# Altium schematic sheet STM32F405RGT6TR.SchDoc
size 431 x 279 mm; SheetNumber: 1; SheetTotal: 1
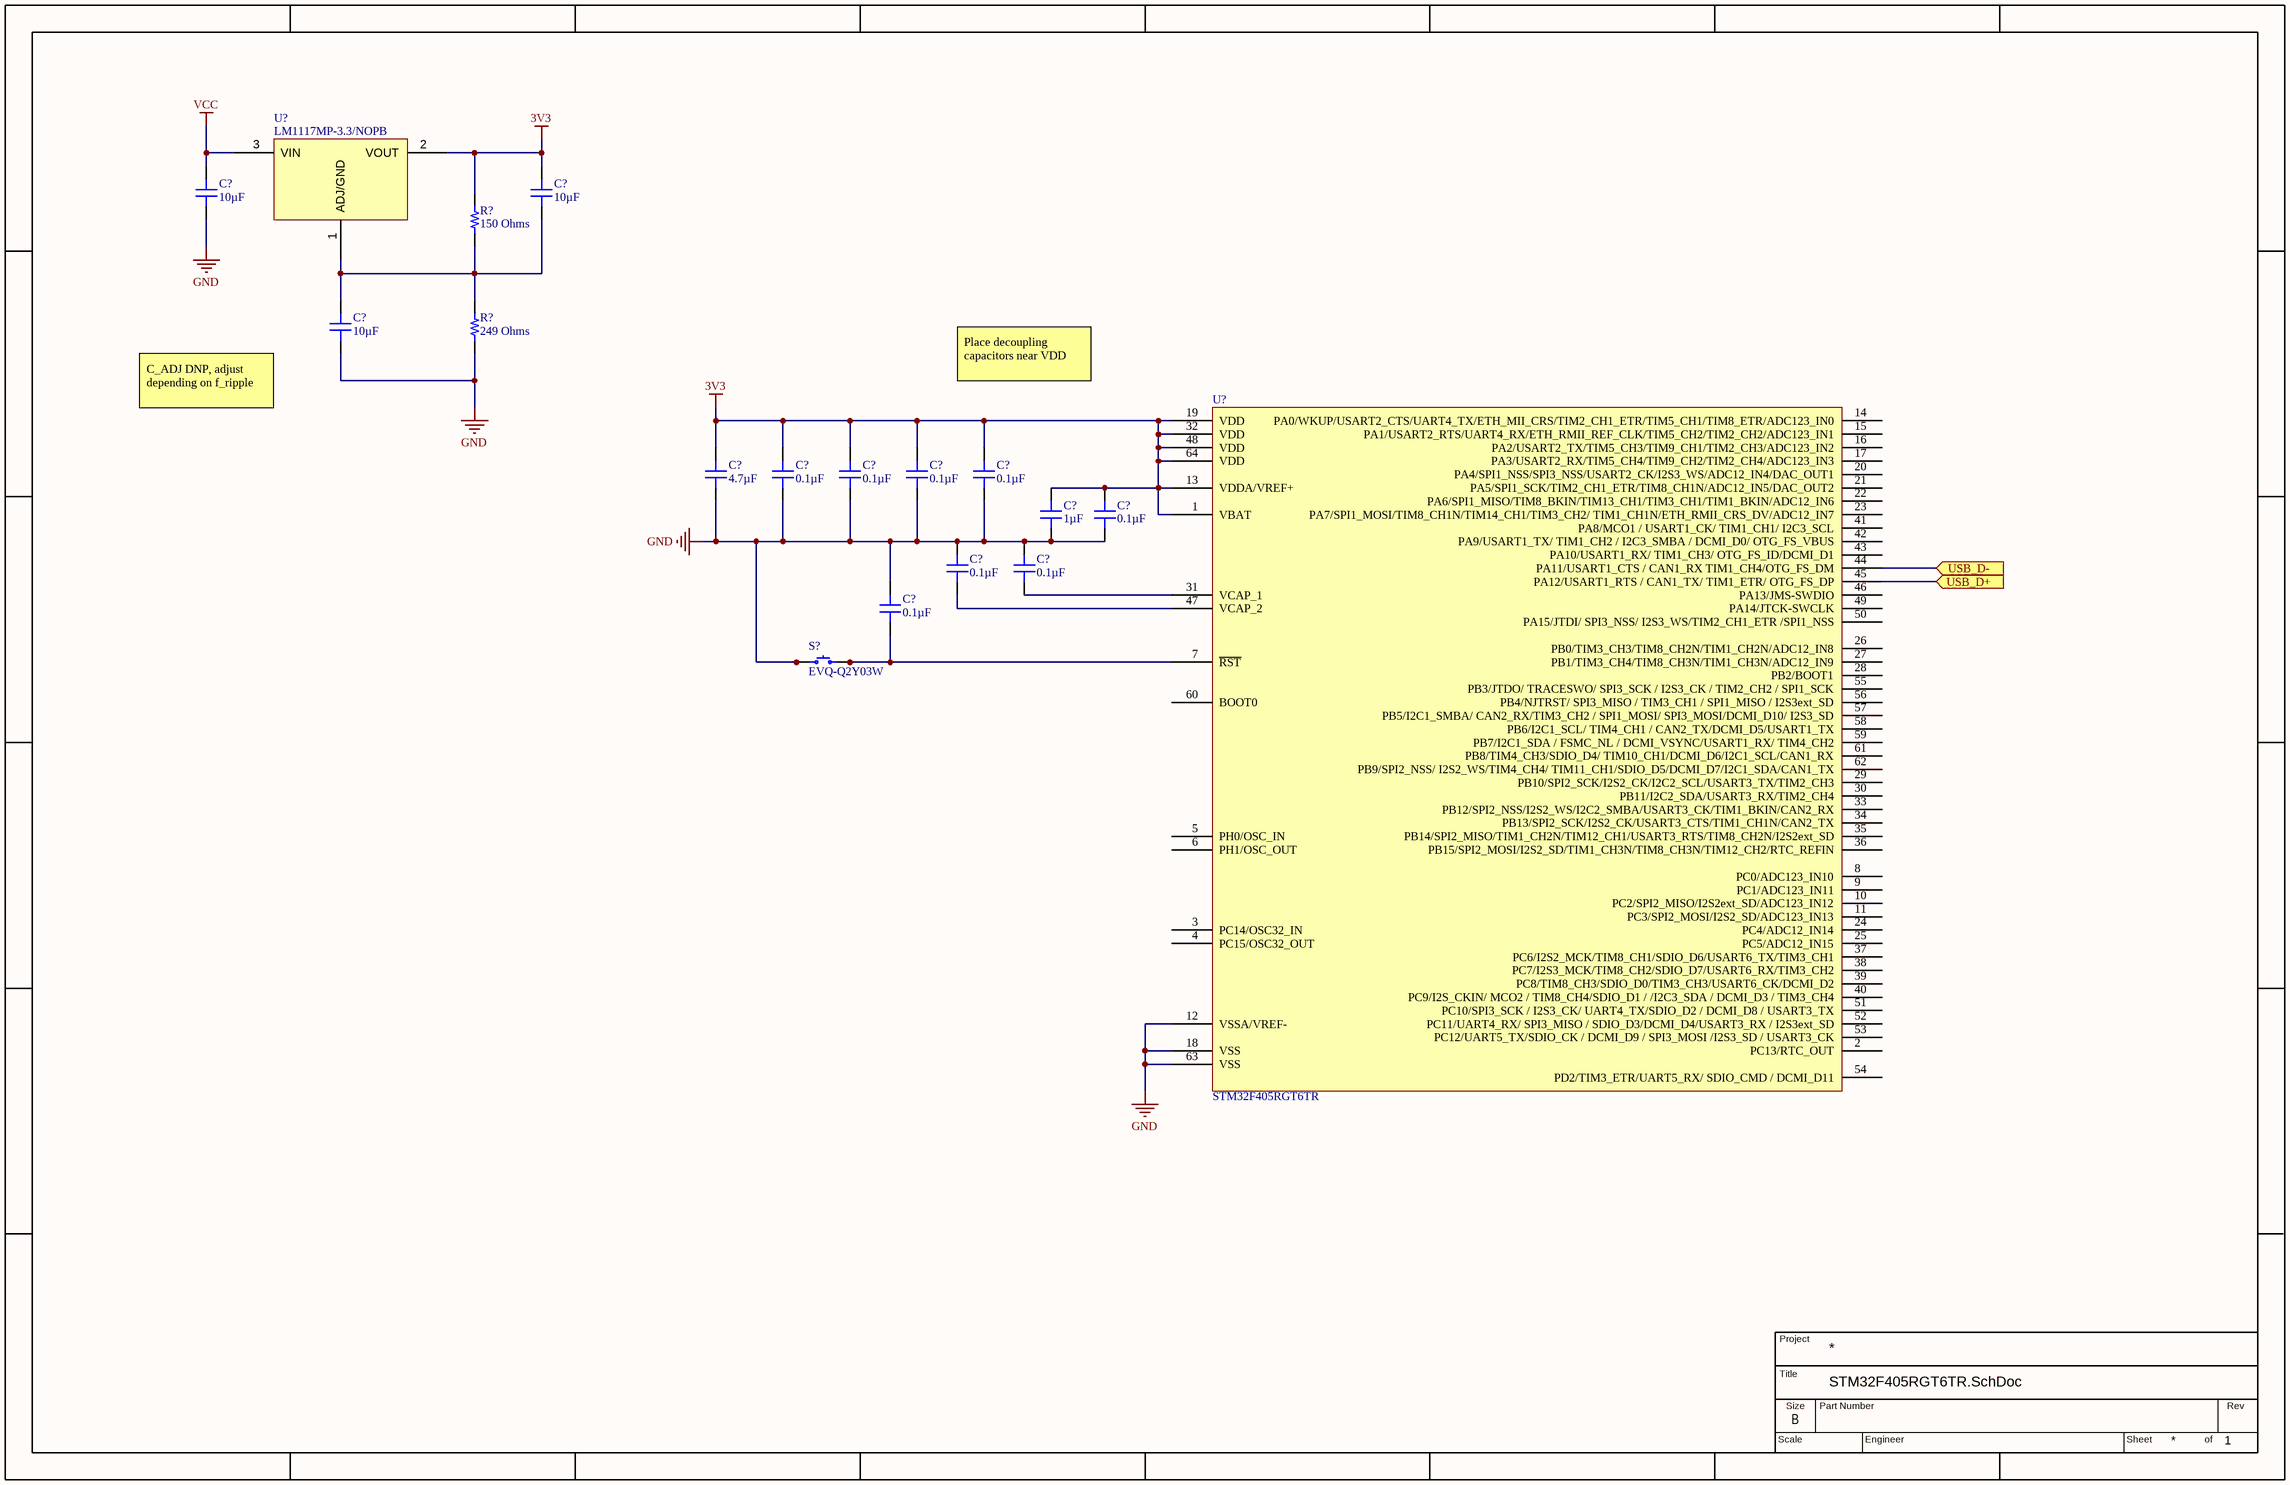
[diagram p0: STM32F405RGT6TR.SchDoc]

## Parts
(Parts that share a designator on the sheet are numbered #1, #2 ... from top to bottom, then left to right.)
C?#1  10µF  [CAP 1210_3225 - 2.8MM]
C?#2  10µF  [CAP 1210_3225 - 2.8MM]
C?#3  10µF  [CAP 1210_3225 - 2.8MM]
C?#4  4.7µF  [CAP 0805_2012]
C?#5  0.1µF  [CAP 0603_1608]
C?#6  0.1µF  [CAP 0603_1608]
C?#7  0.1µF  [CAP 0603_1608]
C?#8  0.1µF  [CAP 0603_1608]
C?#9  1µF  [CAP 0805_2012]
C?#10  0.1µF  [CAP 0603_1608]
C?#11  0.1µF  [CAP 0603_1608]
C?#12  0.1µF  [CAP 0603_1608]
C?#13  0.1µF  [CAP 0603_1608]
R?#1  150 Ohms  [RES 0402_1005]
R?#2  249 Ohms  [RES 0402_1005]
S?  EVQ-Q2Y03W  [PANASONIC EVQQ2]
U?#1  LM1117MP-3.3/NOPB
U?#2  STM32F405RGT6TR  [ST LQFP-64 10X10MM]

## Ports
USB_D+ (in), USB_D- (in)

## Nets
3V3: C?#2.2 C?#4.2 C?#5.2 C?#6.2 C?#7.2 C?#8.2 C?#9.2 C?#10.2 R?#1.2 U?#1.2(VOUT) U?#2.1(VBAT) U?#2.13(VDDA/VREF+) U?#2.19(VDD) U?#2.32(VDD) U?#2.48(VDD) U?#2.64(VDD)
GND: C?#1.1 C?#3.1 C?#4.1 C?#5.1 C?#6.1 C?#7.1 C?#8.1 C?#9.1 C?#10.1 C?#11.1 C?#12.1 C?#13.1 R?#2.1 S?.1 S?.2 U?#2.12(VSSA/VREF-) U?#2.18(VSS) U?#2.63(VSS)
VCC: C?#1.2 U?#1.3(VIN)
USB_D+: U?#2.45(PA12/USART1_RTS_/_CAN1_TX/_TIM1_ETR/_OTG_FS_DP) ; port USB_D+
USB_D-: U?#2.44(PA11/USART1_CTS_/_CAN1_RX_TIM1_CH4/OTG_FS_DM) ; port USB_D-
NetC?#2_1: C?#2.1 C?#3.2 R?#1.1 R?#2.2 U?#1.1(ADJ/GND)
NetC?#11_2: C?#11.2 U?#2.47(VCAP_2)
NetC?#12_2: C?#12.2 U?#2.31(VCAP_1)
NetC?#13_2: C?#13.2 S?.3 S?.4 U?#2.7(~{RST})

Not connected (* = marked no-connect by the designer): U?#2 2(PC13/RTC_OUT) 3(PC14/OSC32_IN) 4(PC15/OSC32_OUT) 5(PH0/OSC_IN) 6(PH1/OSC_OUT) 8(PC0/ADC123_IN10) 9(PC1/ADC123_IN11) 10(PC2/SPI2_MISO/I2S2ext_SD/ADC123_IN12) 11(PC3/SPI2_MOSI/I2S2_SD/ADC123_IN13) 14(PA0/WKUP/USART2_CTS/UART4_TX/ETH_MII_CRS/TIM2_CH1_ETR/TIM5_CH1/TIM8_ETR/ADC123_IN0) 15(PA1/USART2_RTS/UART4_RX/ETH_RMII_REF_CLK/TIM5_CH2/TIM2_CH2/ADC123_IN1) 16(PA2/USART2_TX/TIM5_CH3/TIM9_CH1/TIM2_CH3/ADC123_IN2) 17(PA3/USART2_RX/TIM5_CH4/TIM9_CH2/TIM2_CH4/ADC123_IN3) 20(PA4/SPI1_NSS/SPI3_NSS/USART2_CK/I2S3_WS/ADC12_IN4/DAC_OUT1) 21(PA5/SPI1_SCK/TIM2_CH1_ETR/TIM8_CH1N/ADC12_IN5/DAC_OUT2) 22(PA6/SPI1_MISO/TIM8_BKIN/TIM13_CH1/TIM3_CH1/TIM1_BKIN/ADC12_IN6) 23(PA7/SPI1_MOSI/TIM8_CH1N/TIM14_CH1/TIM3_CH2/_TIM1_CH1N/ETH_RMII_CRS_DV/ADC12_IN7) 24(PC4/ADC12_IN14) 25(PC5/ADC12_IN15) 26(PB0/TIM3_CH3/TIM8_CH2N/TIM1_CH2N/ADC12_IN8) 27(PB1/TIM3_CH4/TIM8_CH3N/TIM1_CH3N/ADC12_IN9) 28(PB2/BOOT1) 29(PB10/SPI2_SCK/I2S2_CK/I2C2_SCL/USART3_TX/TIM2_CH3) 30(PB11/I2C2_SDA/USART3_RX/TIM2_CH4) 33(PB12/SPI2_NSS/I2S2_WS/I2C2_SMBA/USART3_CK/TIM1_BKIN/CAN2_RX) 34(PB13/SPI2_SCK/I2S2_CK/USART3_CTS/TIM1_CH1N/CAN2_TX) 35(PB14/SPI2_MISO/TIM1_CH2N/TIM12_CH1/USART3_RTS/TIM8_CH2N/I2S2ext_SD) 36(PB15/SPI2_MOSI/I2S2_SD/TIM1_CH3N/TIM8_CH3N/TIM12_CH2/RTC_REFIN) 37(PC6/I2S2_MCK/TIM8_CH1/SDIO_D6/USART6_TX/TIM3_CH1) 38(PC7/I2S3_MCK/TIM8_CH2/SDIO_D7/USART6_RX/TIM3_CH2) 39(PC8/TIM8_CH3/SDIO_D0/TIM3_CH3/USART6_CK/DCMI_D2) 40(PC9/I2S_CKIN/_MCO2_/_TIM8_CH4/SDIO_D1_/_/I2C3_SDA_/_DCMI_D3_/_TIM3_CH4) 41(PA8/MCO1_/_USART1_CK/_TIM1_CH1/_I2C3_SCL) 42(PA9/USART1_TX/_TIM1_CH2_/_I2C3_SMBA_/_DCMI_D0/_OTG_FS_VBUS) 43(PA10/USART1_RX/_TIM1_CH3/_OTG_FS_ID/DCMI_D1) 46(PA13/JMS-SWDIO) 49(PA14/JTCK-SWCLK) 50(PA15/JTDI/_SPI3_NSS/_I2S3_WS/TIM2_CH1_ETR_/SPI1_NSS) 51(PC10/SPI3_SCK_/_I2S3_CK/_UART4_TX/SDIO_D2_/_DCMI_D8_/_USART3_TX) 52(PC11/UART4_RX/_SPI3_MISO_/_SDIO_D3/DCMI_D4/USART3_RX_/_I2S3ext_SD) 53(PC12/UART5_TX/SDIO_CK_/_DCMI_D9_/_SPI3_MOSI_/I2S3_SD_/_USART3_CK) 54(PD2/TIM3_ETR/UART5_RX/_SDIO_CMD_/_DCMI_D11) 55(PB3/JTDO/_TRACESWO/_SPI3_SCK_/_I2S3_CK_/_TIM2_CH2_/_SPI1_SCK) 56(PB4/NJTRST/_SPI3_MISO_/_TIM3_CH1_/_SPI1_MISO_/_I2S3ext_SD) 57(PB5/I2C1_SMBA/_CAN2_RX/TIM3_CH2_/_SPI1_MOSI/_SPI3_MOSI/DCMI_D10/_I2S3_SD) 58(PB6/I2C1_SCL/_TIM4_CH1_/_CAN2_TX/DCMI_D5/USART1_TX) 59(PB7/I2C1_SDA_/_FSMC_NL_/_DCMI_VSYNC/USART1_RX/_TIM4_CH2) 60(BOOT0) 61(PB8/TIM4_CH3/SDIO_D4/_TIM10_CH1/DCMI_D6/I2C1_SCL/CAN1_RX) 62(PB9/SPI2_NSS/_I2S2_WS/TIM4_CH4/_TIM11_CH1/SDIO_D5/DCMI_D7/I2C1_SDA/CAN1_TX)

## Notes on the sheet
- C_ADJ DNP, adjust depending on f_ripple
- Place decoupling capacitors near VDD
- Title
- Project
- Scale
- Size
- B
- Part Number
- Engineer
- Sheet
- of
- Rev

## Library data of the parts
C?#1-C?#3 = C1210C106M3RACTU: CAP CER 10UF 25V X7R 1210; Manufacturer: KEMET; Tolerance: ±20%; Part Number: C1210C106M3RACTU; Value: 10µF; Applications: Bypass, Decoupling; Capacitance: 10µF; ComponentLink1Description: Datasheet; ComponentLink1URL: https://api.kemet.com/component-edge/download/datasheet/C1210C106M3RACTU.pdf; ComponentLink2Description: DigiKey Link; ComponentLink2URL: http://digikey.com/product-detail/en/kemet/C1210C106M3RACTU/399-8228-1-ND/3471951; Device Package: 1210 (3225 Metric); LastUpdated: 9/2/2020 1:10:52 AM; Lifecycle Status: Active; Minimum Order: 1; Mounting Type: Surface Mount, MLCC; Operating Temperature: -55°C ~ 125°C; Package / Case: 1210 (3225 Metric); Packaging: TapeAndReel; PartId: 23712; Part Status: Active; Price: 0.14; Series: SMD Comm X7R; Size / Dimension: 0.126" L x 0.098" W (3.20mm x 2.50mm); Supplier 1: DigiKey; Supplier Part Number 1: 399-8228-1-ND; Temperature Coefficient: X7R; Thickness (Max): 0.110" (2.80mm); Voltage - Rated: 25V
C?#4 = CL21B475KPFNNNE: CAP CER 4.7UF 10V X7R 0805; Manufacturer: Samsung Electro-Mechanics; Tolerance: ±10%; Part Number: CL21B475KPFNNNE; Value: 4.7µF; Applications: General Purpose; Capacitance: 4.7µF; ComponentLink1Description: Datasheet; ComponentLink1URL: http://www.samsungsem.com/kr/support/product-search/mlcc/CL21B475KPFNNNE.jsp; ComponentLink2Description: DigiKey Link; ComponentLink2URL: http://digikey.com/product-detail/en/samsung-electro-mechanics/CL21B475KPFNNNE/1276-2972-1-ND/3891058; Device Package: 0805 (2012 Metric); LastUpdated: 9/2/2020 1:04:22 AM; Lifecycle Status: Active; Minimum Order: 1; Mounting Type: Surface Mount, MLCC; Operating Temperature: -55°C ~ 125°C; Package / Case: 0805 (2012 Metric); Packaging: TapeAndReel; PartId: 13116; Part Status: Active; Price: 0.05; Series: CL; Size / Dimension: 0.079" L x 0.049" W (2.00mm x 1.25mm); Supplier 1: DigiKey; Supplier Part Number 1: 1276-2972-1-ND; Temperature Coefficient: X7R; Thickness (Max): 0.053" (1.35mm); Voltage - Rated: 10V
C?#5-C?#8 C?#10-C?#13 = CL10B104JB8NNNC: CAP CER 0.1UF 50V X7R 0603; Manufacturer: Samsung Electro-Mechanics; Tolerance: ±5%; Part Number: CL10B104JB8NNNC; Value: 0.1µF; Applications: General Purpose; Capacitance: 0.1µF; ComponentLink1Description: Datasheet; ComponentLink1URL: http://www.samsungsem.com/kr/support/product-search/mlcc/CL10B104JB8NNNC.jsp; ComponentLink2Description: DigiKey Link; ComponentLink2URL: http://digikey.com/product-detail/en/samsung-electro-mechanics/CL10B104JB8NNNC/1276-1033-1-ND/3889119; Device Package: 0603 (1608 Metric); LastUpdated: 9/2/2020 1:03:30 AM; Lifecycle Status: Active; Minimum Order: 1; Mounting Type: Surface Mount, MLCC; Operating Temperature: -55°C ~ 125°C; Package / Case: 0603 (1608 Metric); Packaging: TapeAndReel; PartId: 5528; Part Status: Active; Price: 0.01; Series: CL; Size / Dimension: 0.063" L x 0.031" W (1.60mm x 0.80mm); Supplier 1: DigiKey; Supplier Part Number 1: 1276-1033-1-ND; Temperature Coefficient: X7R; Thickness (Max): 0.035" (0.90mm); Voltage - Rated: 50V
C?#9 = CL21B105KOFNFNE: CAP CER 1UF 16V X7R 0805; Manufacturer: Samsung Electro-Mechanics; Tolerance: ±10%; Part Number: CL21B105KOFNFNE; Value: 1µF; Applications: General Purpose; Capacitance: 1µF; ComponentLink1Description: Datasheet; ComponentLink1URL: http://www.samsungsem.com/kr/support/product-search/mlcc/CL21B105KOFNFNE.jsp; ComponentLink2Description: DigiKey Link; ComponentLink2URL: http://digikey.com/product-detail/en/samsung-electro-mechanics/CL21B105KOFNFNE/1276-2930-1-ND/3891016; Device Package: 0805 (2012 Metric); LastUpdated: 9/2/2020 1:04:37 AM; Lifecycle Status: Active; Minimum Order: 1; Mounting Type: Surface Mount, MLCC; Operating Temperature: -55°C ~ 125°C; Package / Case: 0805 (2012 Metric); Packaging: TapeAndReel; PartId: 4916; Part Status: Active; Price: 0.02; Series: CL; Size / Dimension: 0.079" L x 0.049" W (2.00mm x 1.25mm); Supplier 1: DigiKey; Supplier Part Number 1: 1276-2930-1-ND; Temperature Coefficient: X7R; Thickness (Max): 0.053" (1.35mm); Voltage - Rated: 16V
R?#1 = ERJ-2RKF1500X: RES SMD 150 OHM 1% 1/10W 0402; Manufacturer: Panasonic Electronic Components; Power (Watts): 0.1W, 1/10W; Temperature Coefficient: ±100ppm/°C; Part Number: ERJ-2RKF1500X; Value: 150 Ohms; ComponentLink1Description: Datasheet; ComponentLink1URL: https://industrial.panasonic.com/cdbs/www-data/pdf/RDA0000/AOA0000C304.pdf; ComponentLink2Description: DigiKey Link; ComponentLink2URL: http://digikey.com/product-detail/en/panasonic-electronic-components/ERJ-2RKF1500X/P150LCT-ND/194191; Composition: Thick Film; Device Package: 0402 (1005 Metric); Features: Automotive AEC-Q200; Height - Seated (Max): 0.016" (0.40mm); LastUpdated: 9/2/2020 1:07:32 AM; Lifecycle Status: Active; Minimum Order: 1; Number of Terminations: 2; Operating Temperature: -55°C ~ 155°C; Package / Case: 0402 (1005 Metric); Packaging: CutTape; PartId: 19630; Part Status: Active; Price: 0.10; Ratings: AEC-Q200; Resistance: 150 Ohms; Series: ERJ; Size / Dimension: 0.039" L x 0.020" W (1.00mm x 0.50mm); Supplier 1: DigiKey; Supplier Part Number 1: P150LCT-ND; Supplier Device Package: 0402; Tolerance: ±1%
R?#2 = RC0402FR-07249RL: RES SMD 249 OHM 1% 1/16W 0402; Manufacturer: Yageo; Power (Watts): 0.063W, 1/16W; Temperature Coefficient: ±100ppm/°C; Part Number: RC0402FR-07249RL; Value: 249 Ohms; ComponentLink1Description: Datasheet; ComponentLink1URL: https://www.yageo.com/upload/media/product/productsearch/datasheet/rchip/PYu-RC_Group_51_RoHS_L_10.pdf; ComponentLink2Description: DigiKey Link; ComponentLink2URL: http://digikey.com/product-detail/en/yageo/RC0402FR-07249RL/311-249LRCT-ND/2827920; Composition: Thick Film; Device Package: 0402 (1005 Metric); Features: Moisture Resistant; Height - Seated (Max): 0.016" (0.40mm); LastUpdated: 9/2/2020 1:07:27 AM; Lifecycle Status: Active; Minimum Order: 1; Number of Terminations: 2; Operating Temperature: -55°C ~ 155°C; Package / Case: 0402 (1005 Metric); Packaging: CutTape; PartId: 20901; Part Status: Active; Price: 0.10; Resistance: 249 Ohms; Series: RC; Size / Dimension: 0.039" L x 0.020" W (1.00mm x 0.50mm); Supplier 1: DigiKey; Supplier Part Number 1: 311-249LRCT-ND; Supplier Device Package: 0402; Tolerance: ±1%
S? = EVQ-Q2Y03W: SWITCH TACTILE SPST-NO 0.02A 15V; Manufacturer: Panasonic Electronic Components; Actuator Height off PCB, Vertical: 3.10mm; Actuator Orientation: Top Actuated; Actuator Type: Standard; Contact Rating @ Voltage: 0.02A @ 15VDC; Illumination: Non-Illuminated; Operating Force: 350gf; Outline: 6.50mm x 6.00mm; Switch Function: Off-Mom; Part Number: EVQ-Q2Y03W; Circuit: SPST-NO; ComponentLink1Description: Datasheet; ComponentLink1URL: https://industrial.panasonic.com/ac/cdn/e/control/switch/light-touch/catalog/sw_lt_eng_6s_th.pdf; ComponentLink2Description: DigiKey Link; ComponentLink2URL: http://digikey.com/product-detail/en/panasonic-electronic-components/EVQ-Q2Y03W/P12961SCT-ND/762951; LastUpdated: 4/9/2020 9:55:13 AM; Lifecycle Status: Active; Minimum Order: 1; Mounting Type: Surface Mount; Operating Temperature: -40°C ~ 85°C; Packaging: TapeAndReel; Part Status: Active; Price: 0.16; Series: EVQQ2; Supplier 1: DigiKey; Supplier Part Number 1: P12961SCT-ND; Termination Style: J Lead
U?#1 = LM1117MP-3.3/NOPB: IC REG LINEAR 3.3V 800MA SOT223
U?#2 = STM32F405RGT6TR: IC MCU 32BIT 1MB FLASH 64LQFP; Manufacturer: STMicroelectronics; Connectivity: CANbus, I²C, IrDA, LINbus, SPI, UART/USART, USB OTG; Core Processor: ARM® Cortex®-M4; Core Size: 32-Bit; Data Converters: A/D 16x12b; D/A 2x12b; Number of I/O: 51; Oscillator Type: Internal; Peripherals: Brown-out Detect/Reset, DMA, I²S, LCD, POR, PWM, WDT; Program Memory Size: 1MB (1M x 8); RAM Size: 192K x 8; Speed: 168MHz; Voltage - Supply (Vcc/Vdd): 1.8V ~ 3.6V; Part Number: STM32F405RGT6TR; ComponentLink1Description: Datasheet; ComponentLink1URL: http://www.st.com/content/ccc/resource/technical/document/datasheet/ef/92/76/6d/bb/c2/4f/f7/DM00037051.pdf/files/DM00037051.pdf/jcr:content/translations/en.DM00037051.pdf; ComponentLink2Description: DigiKey Link; ComponentLink2URL: //digikey.com/product-detail/en/stmicroelectronics/STM32F405RGT6TR/497-17432-2-ND/4755958; Device Package: 64-LQFP; LastUpdated: 12/5/2019 11:45:59 PM; Lifecycle Status: 0; Minimum Order: 1; Mounting Type: Surface Mount; Operating Temperature: -40°C ~ 85°C (TA); Package / Case: 64-LQFP; Packaging: TapeAndReel; PartId: 118; Part Status: Active; Price: 6.14; Program Memory Type: FLASH; Series: STM32F4; Supplier 1: DigiKey; Supplier Part Number 1: 497-17432-2-ND; Supplier Device Package: 64-LQFP (10x10)